# EAGLE design KEYPAD (EAGLE 7.2.0)
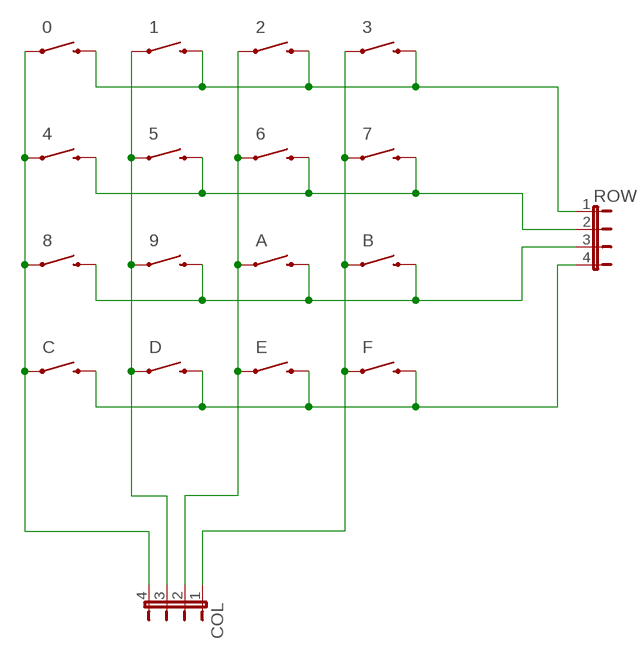
[diagram p0: schematic, sheet 1]

## Parts
0  SWITCH-MOMENTARY-2PTH  [TACTILE-PTH]
1  SWITCH-MOMENTARY-2PTH  [TACTILE-PTH]
2  SWITCH-MOMENTARY-2PTH  [TACTILE-PTH]
3  SWITCH-MOMENTARY-2PTH  [TACTILE-PTH]
4  SWITCH-MOMENTARY-2PTH  [TACTILE-PTH]
5  SWITCH-MOMENTARY-2PTH  [TACTILE-PTH]
6  SWITCH-MOMENTARY-2PTH  [TACTILE-PTH]
7  SWITCH-MOMENTARY-2PTH  [TACTILE-PTH]
8  SWITCH-MOMENTARY-2PTH  [TACTILE-PTH]
9  SWITCH-MOMENTARY-2PTH  [TACTILE-PTH]
A  SWITCH-MOMENTARY-2PTH  [TACTILE-PTH]
B  SWITCH-MOMENTARY-2PTH  [TACTILE-PTH]
C  SWITCH-MOMENTARY-2PTH  [TACTILE-PTH]
COL  JP4E  [JP4]
D  SWITCH-MOMENTARY-2PTH  [TACTILE-PTH]
E  SWITCH-MOMENTARY-2PTH  [TACTILE-PTH]
F  SWITCH-MOMENTARY-2PTH  [TACTILE-PTH]
ROW  JP4E  [JP4]

## Nets
N$1: 0.1 4.1 8.1 C.1 COL.4
N$2: 1.1 5.1 9.1 COL.3 D.1
N$3: 2.1 6.1 A.1 COL.2 E.1
N$4: 3.1 7.1 B.1 COL.1 F.1
N$5: 0.3 1.3 2.3 3.3 ROW.1
N$7: 8.3 9.3 A.3 B.3 ROW.3
N$8: C.3 D.3 E.3 F.3 ROW.4
N$11: 4.3 5.3 6.3 7.3 ROW.2

## Library data of the parts
0 1-9 A B C D E F = SparkFun-Electromechanical:SWITCH-MOMENTARY-2: Various NO switches- pushbuttons, reed, etc; PROD_ID: SWCH-08441
COL ROW = jumper:JP4E: JUMPER

## Board
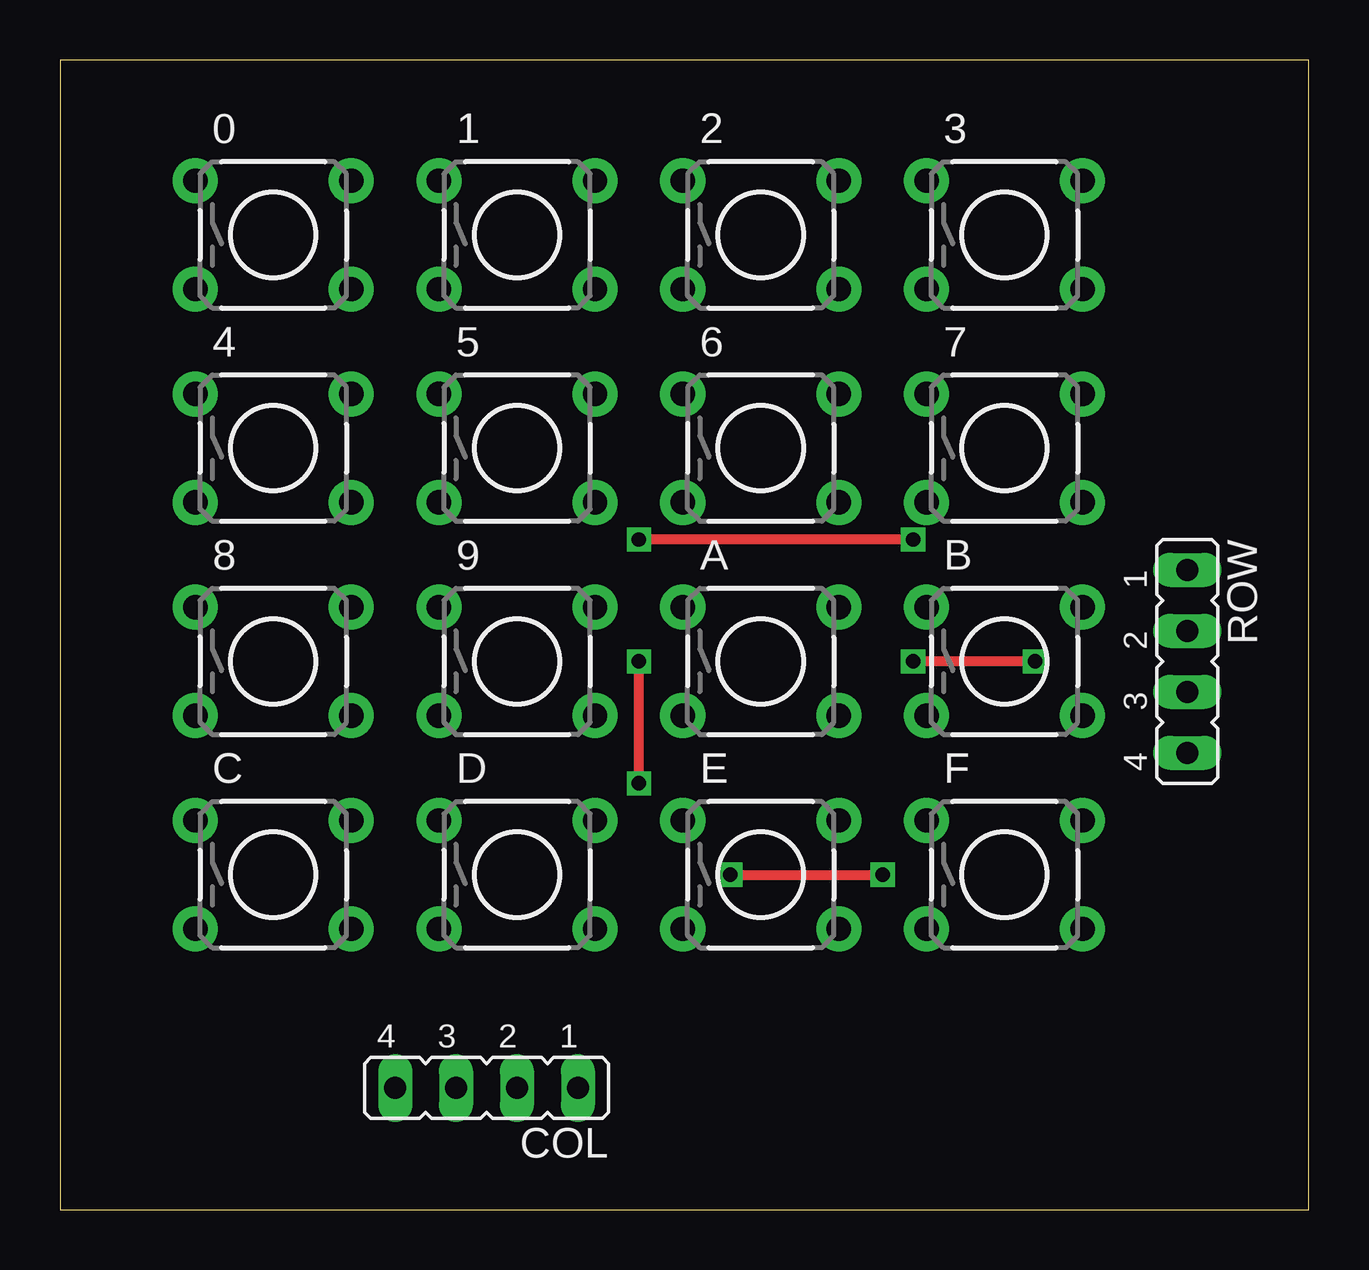
[diagram p1: board, top side]
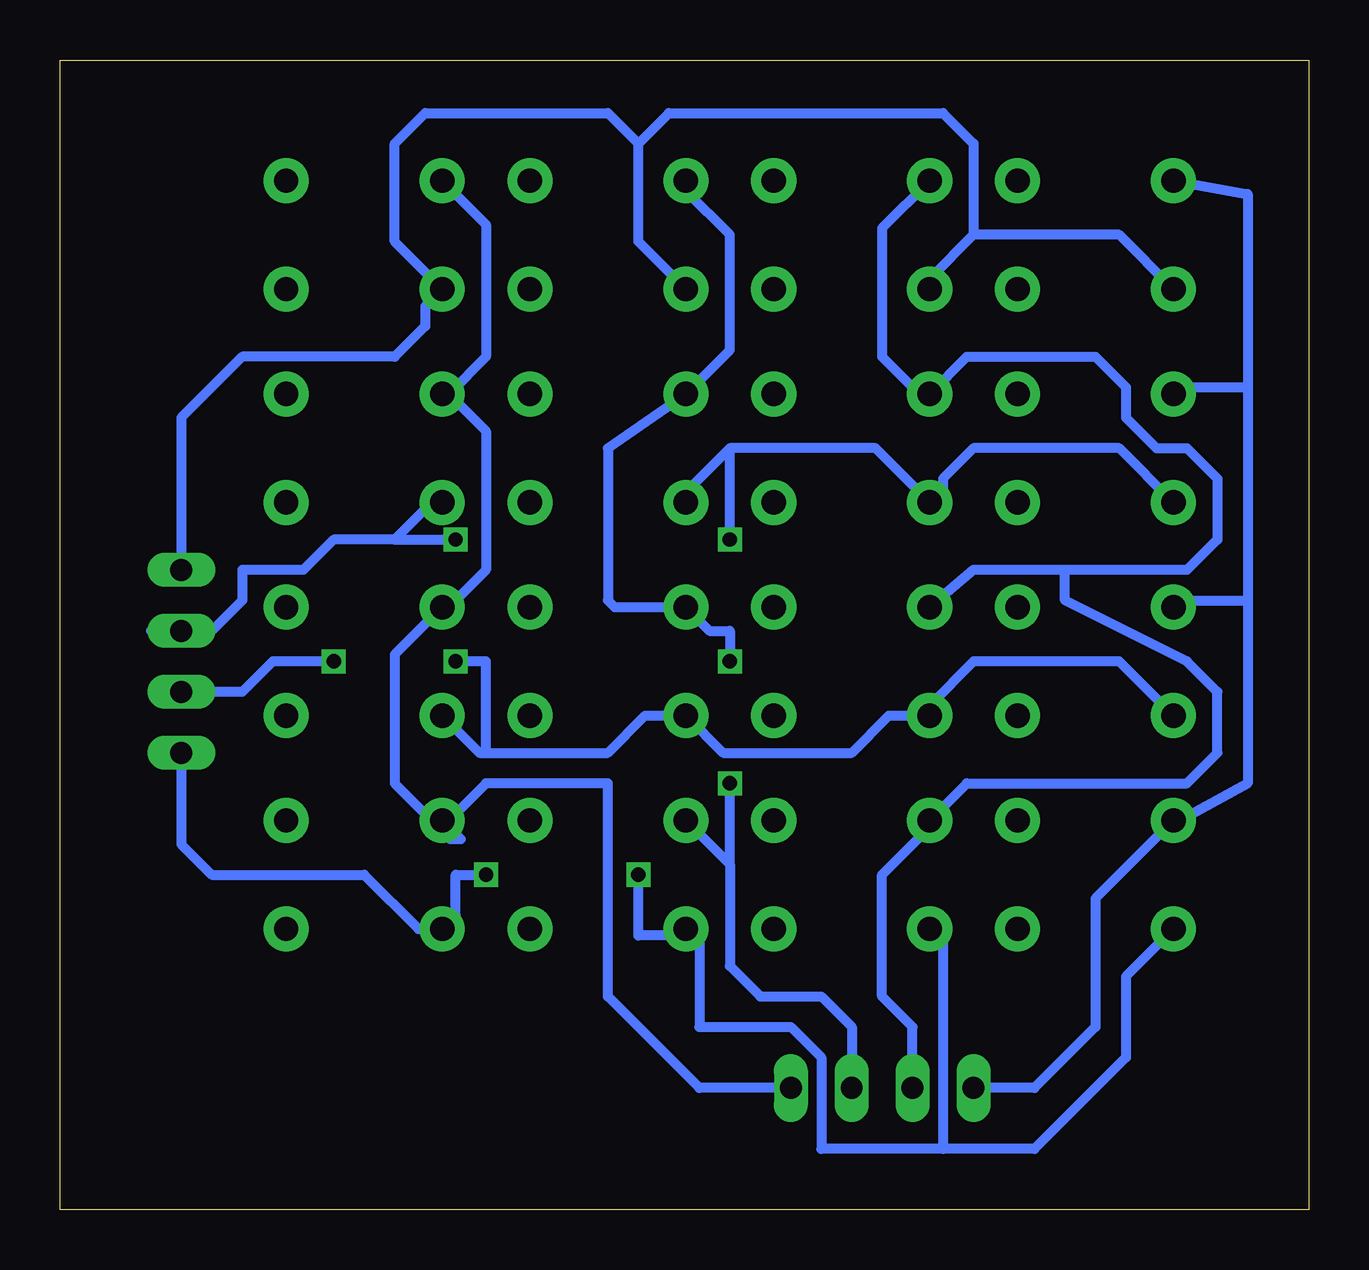
[diagram p2: board, bottom side, seen from below]

Size 52.05 x 47.93 mm. Coordinates in mm from the lower left corner, seen from the top.
Outline: 0,0 52.05,0 52.05,47.93 0,47.93 0,0
Copper layers (1*16): Top 0.035mm / dielectric 1.5mm / Bottom 0.035mm
Design rules "default": minimum track width 10mil, minimum drill 24mil, track to track 8mil, track to pad 8mil, pad to pad 8mil, via to via 8mil, smd to smd 8mil, copper to edge 40mil, drill to drill 8mil, minimum pad ring 10mil, minimum via ring 8mil, stop-mask expansion 4mil, vias tented up to drill 0mil, thermal gap 10mil

### Footprints (pad centres in the part's own frame; a part is rotated, then mirrored left to right if it is on the bottom)
TACTILE-PTH = drill 1.016 pad 1.88: 1 -3.251,2.261; 2 3.251,2.261; 3 -3.251,-2.261; 4 3.251,-2.261
JP4 = drill 0.914 long: 1 -3.81,0; 2 -1.27,0; 3 1.27,0; 4 3.81,0

### Placement (x,y rotation side)
0  8.89,40.64 0 top
1  19.05,40.64 0 top
2  29.21,40.64 0 top
3  39.37,40.64 0 top
4  8.89,31.75 0 top
5  19.05,31.75 0 top
6  29.21,31.75 0 top
7  39.37,31.75 0 top
8  8.89,22.86 0 top
9  19.05,22.86 0 top
A  29.21,22.86 0 top
B  39.37,22.86 0 top
C  8.89,13.97 0 top
COL  17.78,5.08 180 top
D  19.05,13.97 0 top
E  29.21,13.97 0 top
F  39.37,13.97 0 top
ROW  46.99,22.86 270 top

### Tracks (layer width: path | path; a pad name or v marks a point on that pad's centre or on a via)
N$1
  Bottom 0.406: 0.1 2.54,42.34 2.54,34.29 | 2.54,34.29 2.54,25.4 | 2.54,25.4 2.54,17.78 5.36,16.23 C.1 8.89,12.98 8.89,7.62 11.43,5.08 COL.4 | 8.1 5.36,25.4 2.54,25.4 | 4.1 5.36,34.29 2.54,34.29
N$2
  Bottom 0.406: 1.1 17.78,40.92 17.78,35.56 16.23,34.01 5.1 14.25,35.56 8.89,35.56 7.62,34.29 7.62,33.02 6.35,31.75 5.08,31.75 3.81,30.48 3.81,27.94 5.08,26.67 10.16,26.67 | COL.3 16.51,7.62 17.78,8.89 17.78,13.97 15.8,15.95 D.1 14.25,17.78 5.08,17.78 3.81,19.05 3.81,21.59 5.08,22.86 10.16,25.4 10.16,26.67 | 10.16,26.67 13.97,26.67 9.1
N$3  (via drill 0.6)
  Top 0.406: v24.13,17.78 v24.13,22.86
  Bottom 0.406: 2.1 25.96,42.47 24.13,40.64 24.13,35.84 6.1 29.21,31.75 29.21,25.4 28.93,25.12 A.1 24.97,24.13 24.13,24.13 v24.13,22.86 | E.1 24.13,14.4 | 24.13,14.4 24.13,10.16 22.86,8.89 20.32,8.89 19.05,7.62 COL.2 | 24.13,14.4 v24.13,17.78
N$4
  Bottom 0.406: 3.1 34.29,41.07 34.29,35.56 35.84,34.01 | 35.84,34.01 7.1 | 35.84,34.01 34.29,32.46 34.29,26.67 35.84,25.12 B.1 38.1,23.14 38.1,17.78 35.78,15.46 35.34,15.46 F.1 35.84,16.23 34.29,17.78 29.21,17.78 29.21,8.89 25.4,5.08 COL.1
N$5
  Bottom 0.406: 0.3 7.9,40.64 13.97,40.64 | 13.97,40.64 15.8,38.81 1.3 | 2.3 27.94,40.36 27.94,44.45 | 27.94,44.45 26.67,45.72 15.24,45.72 13.97,44.45 13.97,40.64 | 27.94,44.45 29.21,45.72 36.83,45.72 38.1,44.45 38.1,40.36 3.3 36.83,37.67 36.83,36.83 38.1,35.56 44.45,35.56 46.99,33.02 ROW.1
N$7  (via drill 0.6)
  Top 0.406: v40.64,22.86 v35.56,22.86
  Bottom 0.406: B.3 34.57,19.05 34.29,19.05 | 34.29,19.05 29.21,19.05 27.66,20.6 A.3 24.41,19.05 19.05,19.05 17.5,20.6 9.3 15.8,21.03 13.97,22.86 7.9,22.86 8.3 | 34.29,19.05 34.29,22.86 v35.56,22.86 | v40.64,22.86 43.18,22.86 44.45,21.59 ROW.3
N$8  (via drill 0.6)
  Top 0.406: v27.94,13.97 v34.29,13.97
  Bottom 0.406: 15.24,2.54 20.32,2.54 20.32,6.35 21.59,7.62 25.4,7.62 25.4,11.15 E.3 26.24,11.43 27.94,11.43 v27.94,13.97 | D.3 15.24,11.15 15.24,2.54 | ROW.4 46.99,15.24 45.72,13.97 39.37,13.97 37.11,11.71 F.3 35.56,12.27 35.56,13.97 v34.29,13.97 | C.3 7.62,9.73 7.62,6.35 11.43,2.54 15.24,2.54
N$11  (via drill 0.6)
  Top 0.406: v35.56,27.94 v24.13,27.94
  Bottom 0.406: 24.13,31.75 18.06,31.75 5.3 15.52,29.49 15.24,29.21 15.24,30.48 13.97,31.75 7.9,31.75 4.3 | 24.13,31.75 25.96,29.92 6.3 | 38.1,27.94 36.55,29.49 7.3 | 38.1,27.94 v35.56,27.94 | v24.13,27.94 24.13,31.75 | 38.1,27.94 40.64,27.94 41.91,26.67 44.45,26.67 44.45,25.4 45.72,24.13 ROW.2 48.26,24.13